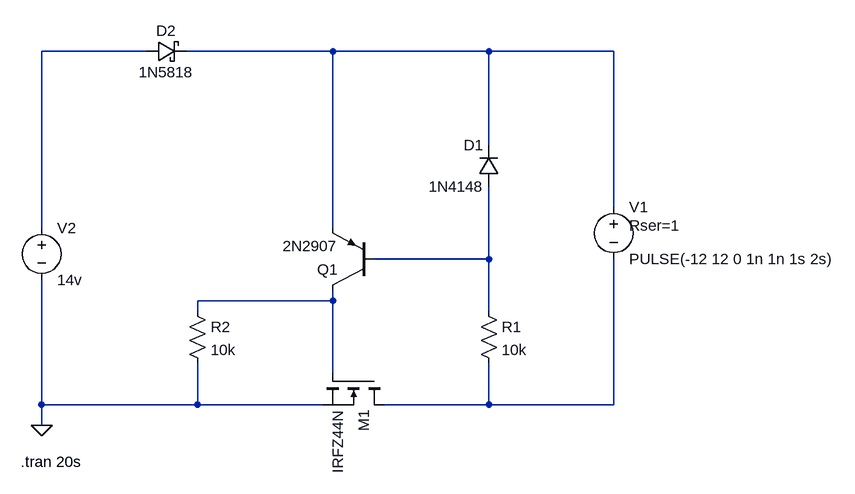
[diagram p0: schematic Reverse polarity protection.asc]
Reverse polarity protection.asc, the LTspice schematic file:
Version 4
SHEET 1 952 680
WIRE -128 -736 -288 -736
WIRE 160 -736 -64 -736
WIRE 400 -736 160 -736
WIRE 592 -736 400 -736
WIRE 400 -592 400 -736
WIRE 592 -496 592 -736
WIRE -288 -464 -288 -736
WIRE 160 -464 160 -736
WIRE 400 -416 400 -528
WIRE 400 -416 224 -416
WIRE 160 -352 160 -368
WIRE 160 -352 -48 -352
WIRE -48 -336 -48 -352
WIRE 400 -336 400 -416
WIRE 160 -240 160 -352
WIRE -288 -192 -288 -384
WIRE -48 -192 -48 -256
WIRE -48 -192 -288 -192
WIRE 144 -192 -48 -192
WIRE 400 -192 400 -256
WIRE 400 -192 240 -192
WIRE 592 -192 592 -416
WIRE 592 -192 400 -192
WIRE -288 -160 -288 -192
FLAG -288 -160 0
SYMBOL nmos 240 -240 R90
SYMATTR InstName M1
SYMATTR Value IRFZ44N
SYMBOL pnp 224 -368 R180
SYMATTR InstName Q1
SYMATTR Value 2N2907
SYMBOL res 384 -352 R0
SYMATTR InstName R1
SYMATTR Value 10k
SYMBOL diode 416 -528 R180
WINDOW 0 24 64 Left 2
WINDOW 3 24 0 Left 2
SYMATTR InstName D1
SYMATTR Value 1N4148
SYMBOL res -64 -352 R0
SYMATTR InstName R2
SYMATTR Value 10k
SYMBOL voltage -288 -480 R0
WINDOW 123 0 0 Left 0
WINDOW 39 0 0 Left 0
SYMATTR InstName V2
SYMATTR Value 14v
SYMBOL schottky -128 -720 R270
WINDOW 0 32 32 VTop 2
WINDOW 3 0 32 VBottom 2
SYMATTR InstName D2
SYMATTR Value 1N5818
SYMATTR Description Diode
SYMATTR Type diode
SYMBOL voltage 592 -512 R0
WINDOW 123 0 0 Left 0
WINDOW 39 24 44 Left 2
SYMATTR InstName V1
SYMATTR Value PULSE(-12 12 0 1n 1n 1s 2s)
SYMATTR SpiceLine Rser=1
TEXT -320 -104 Left 2 !.tran 20s

The netlist it stands for:
* Reverse polarity protection.asc
M1 N005 N004 0 0 IRFZ44N
Q1 N004 N003 N002 0 2N2907
R1 N003 N005 10k
D1 N003 N002 1N4148
R2 N004 0 10k
V2 N001 0 14v
D2 N001 N002 1N5818
V1 N002 N005 PULSE(-12 12 0 1n 1n 1s 2s) Rser=1
.model D D
.lib standard.dio
.model NPN NPN
.model PNP PNP
.lib standard.bjt
.model NMOS NMOS
.model PMOS PMOS
.lib standard.mos
.tran 20s
.backanno
.end